# EAGLE design esp32_module (EAGLE 9.6.2)

## Sheet 1 of 2
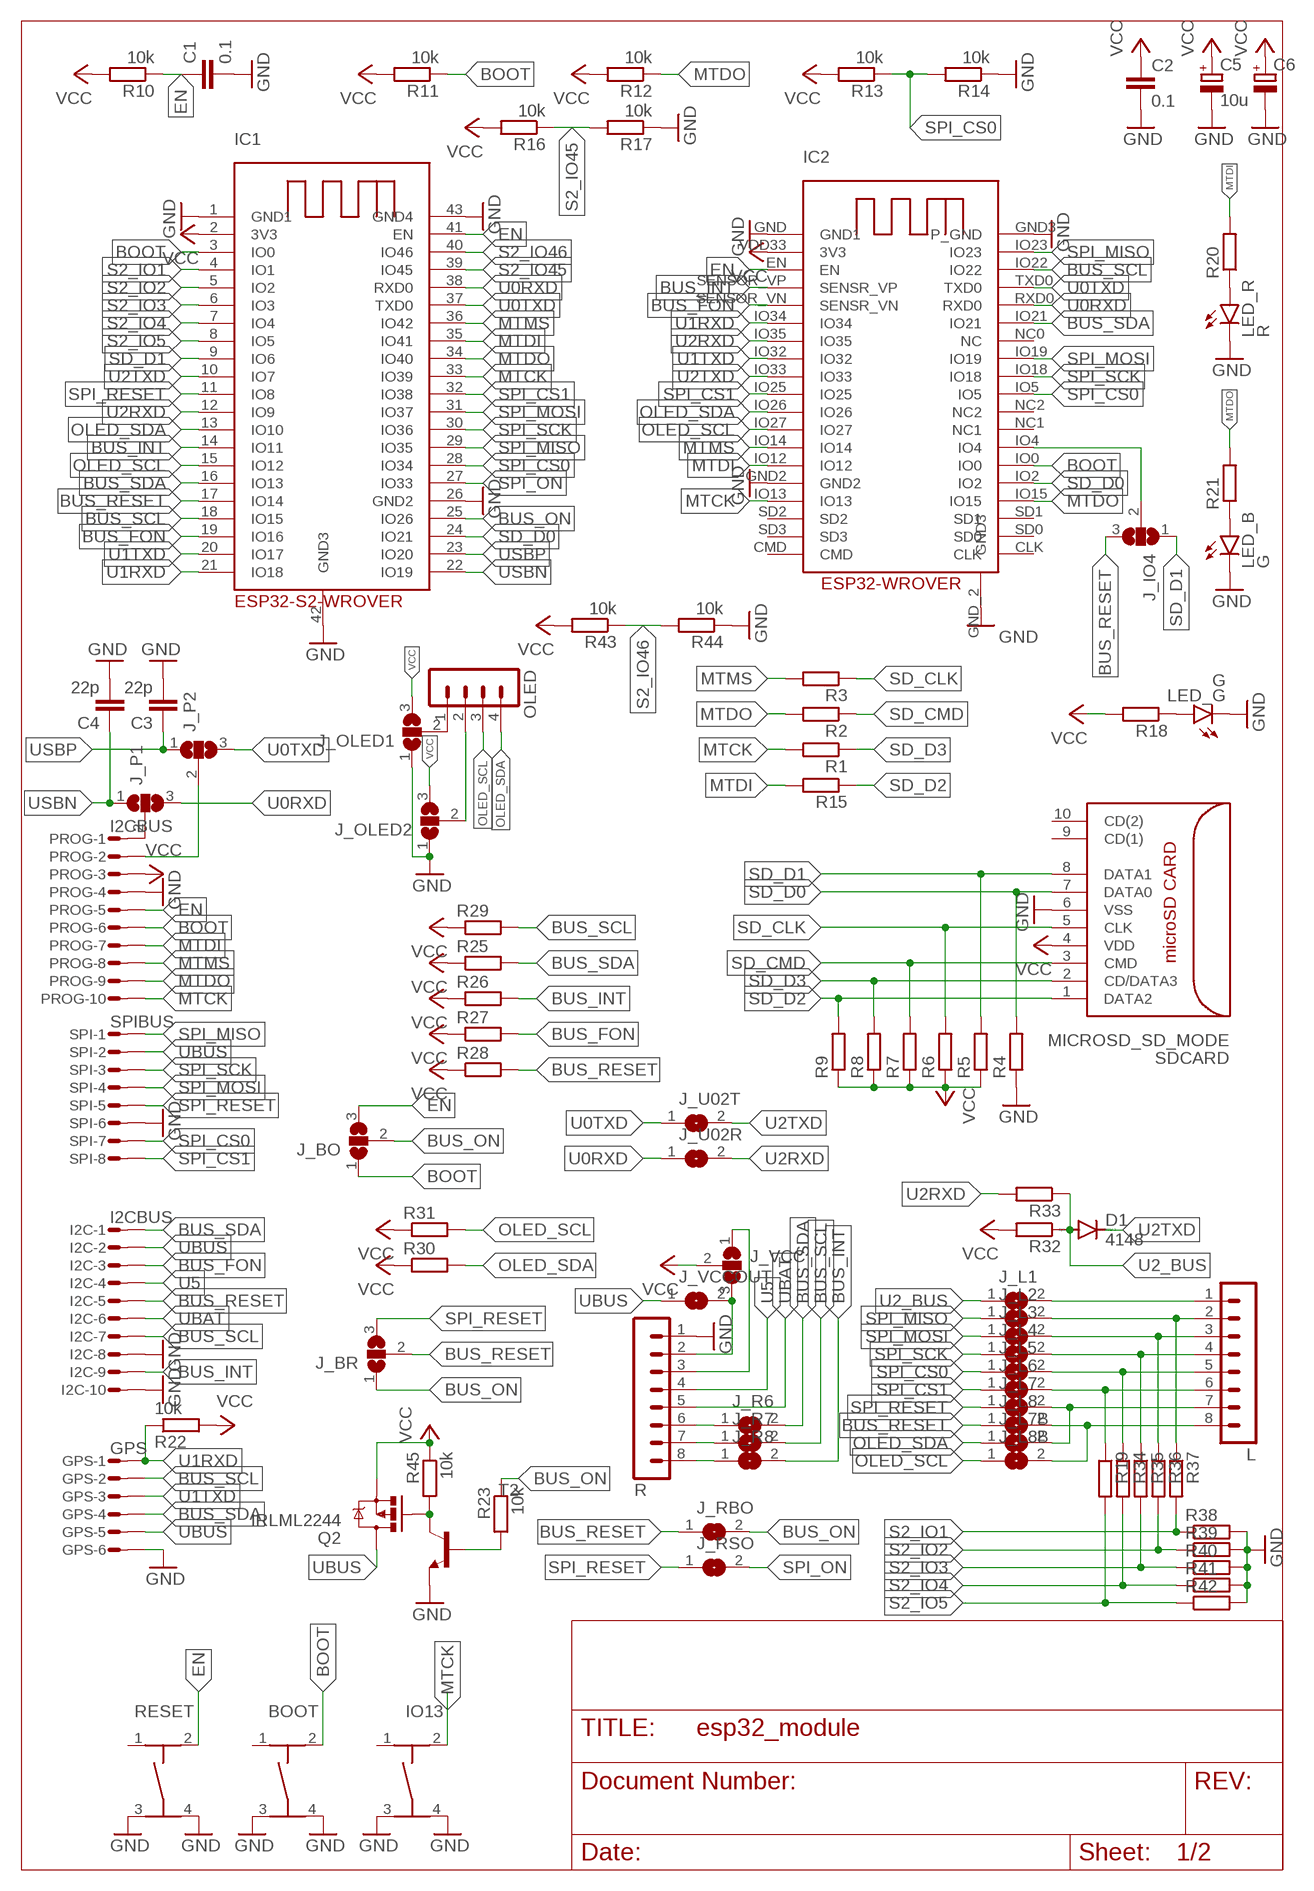
[diagram p0: schematic, sheet 1]

### Parts
BOOT  TASTER-9314_SMD  [TASTER-9314_SMD]
C1  0.1  C-EUC0805  [C0805]
C2  0.1  C-EUC0805  [C0805]
C3  22p  C-EUC0805  [C0805]
C4  22p  C-EUC0805  [C0805]
C5  10u  CPOL-EUB/3528-21W  [B/3528-21W]
C6  CPOL-EUC/6032-28R  [C/6032-28R]
D1  4148  DIODE-MINIMELF  [MINIMELF]
GPS  GPS  MICROMATCH-6SMD  [MICROMATCH-6SMD]
I2C  I2CBUS  MICROMATCH-10SMD  [MICROMATCH-10SMD]
IC1  ESP32-S2_WROVER  [ESP32-S2-WROVER]
IC2  ESP32-WROVER  [ESP32-WROVER]
IO13  TASTER-9314_SMD  [TASTER-9314_SMD]
J_BO  SJ2W  [SJ_2]
J_BR  SJ2W  [SJ_2]
J_IO4  SJ2W  [SJ_2]
J_L1  SJ  [SJ]
J_L2  SJ  [SJ]
J_L3  SJ  [SJ]
J_L4  SJ  [SJ]
J_L5  SJ  [SJ]
J_L6  SJ  [SJ]
J_L7  SJ  [SJ]
J_L7B  SJ  [SJ]
J_L8  SJ  [SJ]
J_L8B  SJ  [SJ]
J_OLED1  SJ2W  [SJ_2]
J_OLED2  SJ2W  [SJ_2]
J_P1  SJ2W  [SJ_2]
J_P2  SJ2W  [SJ_2]
J_R6  SJ  [SJ]
J_R7  SJ  [SJ]
J_R8  SJ  [SJ]
J_RBO  SJ  [SJ]
J_RSO  SJ  [SJ]
J_U02R  SJ  [SJ]
J_U02T  SJ  [SJ]
J_VCC  SJ2W  [SJ_2]
J_VCCOUT  SJ  [SJ]
L  MA08-1  [MA08-1]
LED_B  G  LEDCHIPLED_0805  [CHIPLED_0805]
LED_G  G  LEDCHIPLED_0805  [CHIPLED_0805]
LED_R  R  LEDCHIPLED_0805  [CHIPLED_0805]
OLED  MA04-1  [MA04-1]
PROG  I2CBUS  MICROMATCH-10SMD  [MICROMATCH-10SMD]
Q2  IRLML2244  MOSFET-PCHANNELIRLML2244  [SOT23-3]
R  MA08-1  [MA08-1]
R1  R-EU_R0805  [R0805]
R2  R-EU_R0805  [R0805]
R3  R-EU_R0805  [R0805]
R4  R-EU_R0805  [R0805]
R5  R-EU_R0805  [R0805]
R6  R-EU_R0805  [R0805]
R7  R-EU_R0805  [R0805]
R8  R-EU_R0805  [R0805]
R9  R-EU_R0805  [R0805]
R10  10k  R-EU_R0805  [R0805]
R11  10k  R-EU_R0805  [R0805]
R12  10k  R-EU_R0805  [R0805]
R13  10k  R-EU_R0805  [R0805]
R14  10k  R-EU_R0805  [R0805]
R15  R-EU_R0805  [R0805]
R16  10k  R-EU_R0805  [R0805]
R17  10k  R-EU_R0805  [R0805]
R18  R-EU_R0603  [R0603]
R19  R-EU_R0805  [R0805]
R20  R-EU_R0603  [R0603]
R21  R-EU_R0603  [R0603]
R22  10k  R-EU_R0805  [R0805]
R23  10k  R-EU_R0805  [R0805]
R25  R-EU_R0805  [R0805]
R26  R-EU_R0805  [R0805]
R27  R-EU_R0805  [R0805]
R28  R-EU_R0805  [R0805]
R29  R-EU_R0805  [R0805]
R30  R-EU_R0805  [R0805]
R31  R-EU_R0805  [R0805]
R32  R-EU_R0805  [R0805]
R33  R-EU_R0805  [R0805]
R34  R-EU_R0805  [R0805]
R35  R-EU_R0805  [R0805]
R36  R-EU_R0805  [R0805]
R37  R-EU_R0805  [R0805]
R38  R-EU_R0805  [R0805]
R39  R-EU_R0805  [R0805]
R40  R-EU_R0805  [R0805]
R41  R-EU_R0805  [R0805]
R42  R-EU_R0805  [R0805]
R43  10k  R-EU_R0805  [R0805]
R44  10k  R-EU_R0805  [R0805]
R45  10k  R-EU_R0805  [R0805]
RESET  TASTER-9314_SMD  [TASTER-9314_SMD]
SDCARD  MICROSD_SD_MODE  [MICRO_SD_CONNECTOR]
SPI  SPIBUS  MICROMATCH-8SMD  [MICROMATCH-8-SMD]
T2  BC817-16-NPN-SOT23-BEC  [SOT23-BEC]

### Nets
BOOT: BOOT.2 IC1.3(IO0) IC2.IO0 J_BO.1 PROG.6 R11.1
BUS_FON: I2C.3 IC1.19(IO16) IC2.SENSOR_VN(SENSR_VN) R27.2
BUS_INT: I2C.9 IC1.14(IO11) IC2.SENSOR_VP(SENSR_VP) J_R8.2 R26.2
BUS_ON: IC1.25(IO26) J_BO.2 J_BR.1 J_RBO.2 R23.1
BUS_RESET: I2C.5 IC1.17(IO14) J_BR.2 J_IO4.3 J_L8.1 J_RBO.1 R28.2
BUS_SCL: GPS.2 I2C.7 IC1.18(IO15) IC2.IO22 J_R7.2 R29.2
BUS_SDA: GPS.4 I2C.1 IC1.16(IO13) IC2.IO21 J_R6.2 R25.2
EN: C1.1 IC1.41(EN) IC2.EN J_BO.3 PROG.5 R10.1 RESET.2
GND [gnd]: BOOT.3 BOOT.4 C1.2 C2.2 C3.2 C4.2 C5.- C6.- GPS.6 I2C.8 I2C.10 IC1.1(GND1) IC1.26(GND2) IC1.42(GND3) IC1.43(GND4) IC2.GND2 IC2.GND3(P_GND) IC2.GND(GND1) IC2.GND_2(GND3) IO13.3 IO13.4 J_OLED1.1 J_OLED2.1 LED_B.C LED_G.C LED_R.C PROG.4 R4.1 R14.1 R17.1 R38.2 R39.2 R40.2 R41.2 R42.2 R44.1 R.1 RESET.3 RESET.4 SDCARD.6(VSS) SPI.6 T2.E
LCD_1 [power]: J_OLED1.2 OLED.1
LCD_2 [power]: J_OLED2.2 OLED.2
MTCK: IC1.33(IO39) IC2.IO13 IO13.2 PROG.10 R1.2
MTDI: IC1.35(IO41) IC2.IO12 PROG.7 R15.2 R20.2
MTDO: IC1.34(IO40) IC2.IO15 PROG.9 R2.2 R12.1 R21.2
MTMS: IC1.36(IO42) IC2.IO14 PROG.8 R3.2
N$1: IC2.IO4 J_IO4.2
N$2: Q2.1(G) R45.2 T2.C
N$3: J_R6.1 R.6
N$4: LED_G.A R18.1
N$5: J_R7.1 R.7
N$6: J_P1.2 PROG.1
N$12: J_R8.1 R.8
N$18: R23.2 T2.B
N$20: LED_R.A R20.1
N$21: LED_B.A R21.1
N$24: J_L7.2 J_L7B.2 L.7
N$25: J_L6.2 L.6 R19.1
N$27: J_L8.2 J_L8B.2 L.8
N$28: J_L5.2 L.5 R34.1
N$29: J_L4.2 L.4 R35.1
N$30: J_L2.2 L.2 R37.1
N$31: J_L3.2 L.3 R36.1
N$32: J_L1.2 L.1
N$34: J_P2.2 PROG.2
OLED_SCL: IC1.15(IO12) IC2.IO27 J_L8B.1 OLED.3 R31.2
OLED_SDA: IC1.13(IO10) IC2.IO26 J_L7B.1 OLED.4 R30.2
S2_IO1: IC1.4(IO1) R37.2 R38.1
S2_IO2: IC1.5(IO2) R36.2 R39.1
S2_IO3: IC1.6(IO3) R35.2 R40.1
S2_IO4: IC1.7(IO4) R34.2 R41.1
S2_IO5: IC1.8(IO5) R19.2 R42.1
S2_IO45: IC1.39(IO45) R16.1 R17.2
S2_IO46: IC1.40(IO46) R43.1 R44.2
SD_CLK: R3.1 R6.2 SDCARD.5(CLK)
SD_CMD: R2.1 R7.2 SDCARD.3(CMD)
SD_D0: IC1.24(IO21) IC2.IO2 R4.2 SDCARD.7(DATA0)
SD_D1: IC1.9(IO6) J_IO4.1 R5.2 SDCARD.8(DATA1)
SD_D2: R9.2 R15.1 SDCARD.1(DATA2)
SD_D3: R1.1 R8.2 SDCARD.2(CD/DATA3)
SPI_CS0: IC1.28(IO34) IC2.IO5 J_L5.1 R13.1 R14.2 SPI.7
SPI_CS1: IC1.32(IO38) IC2.IO25 J_L6.1 SPI.8
SPI_MISO: IC1.29(IO35) IC2.IO23 J_L2.1 SPI.1
SPI_MOSI: IC1.31(IO37) IC2.IO19 J_L3.1 SPI.4
SPI_ON: IC1.27(IO33) J_RSO.2
SPI_RESET: IC1.11(IO8) J_BR.3 J_L7.1 J_RSO.1 SPI.5
SPI_SCK: IC1.30(IO36) IC2.IO18 J_L4.1 SPI.3
U0RXD: IC1.38(RXD0) IC2.RXD0 J_P1.3 J_U02R.1
U0TXD: IC1.37(TXD0) IC2.TXD0 J_P2.3 J_U02T.1
U1RXD: GPS.1 IC1.21(IO18) IC2.IO34 R22.1
U1TXD: GPS.3 IC1.20(IO17) IC2.IO32
U2_BUS: D1.A J_L1.1 R32.1 R33.1
U2RXD: IC1.12(IO9) IC2.IO35 J_U02R.2 R33.2
U2TXD: D1.C IC1.10(IO7) IC2.IO33 J_U02T.2
U5 [power]: I2C.4 R.4
U33A [power]: J_VCC.3 J_VCCOUT.2 R.2
U33B [power]: J_VCC.1 R.3
UBAT [power]: I2C.6 R.5
UBUS [power]: GPS.5 I2C.2 J_VCCOUT.1 Q2.3(D) SPI.2
USBN: C4.1 IC1.22(IO19) J_P1.1
USBP: C3.1 IC1.23(IO20) J_P2.1
VCC [power]: C2.1 C5.+ C6.+ IC1.2(3V3) IC2.VDD33(3V3) J_OLED1.3 J_OLED2.3 J_VCC.2 PROG.3 Q2.2(S) R5.1 R6.1 R7.1 R8.1 R9.1 R10.2 R11.2 R12.2 R13.2 R16.2 R18.2 R22.2 R25.1 R26.1 R27.1 R28.1 R29.1 R30.1 R31.1 R32.2 R43.2 R45.1 SDCARD.4(VDD)
Unconnected: BOOT.1 IC2.CLK IC2.CMD IC2.NC0(NC) IC2.NC1 IC2.NC2 IC2.SD0 IC2.SD1 IC2.SD2 IC2.SD3 IO13.1 RESET.1 SDCARD.9(CD(1)) SDCARD.10(CD(2))

## Sheet 2 of 2

## Library data of the parts
BOOT IO13 RESET = Ergaenzung:TASTER-9314_SMD
C1-C4 = rcl:C-EU: CAPACITOR, European symbol; SPICEPREFIX: C
C5 C6 = rcl:CPOL-EU: POLARIZED CAPACITOR, European symbol; SPICEPREFIX: C
D1 = diode:DIODE-: DIODE
GPS = con-amp-micromatch:MICROMATCH-6: MicroMaTch 6 7-215464-6 / 0-215464-6 Drawing Number C-215464 DDEController.pdf
I2C PROG = con-amp-micromatch:MICROMATCH-10: MicroMaTch 10 8-215464-0 / 1-215464-0 Drawing Number C-215464 DDEController.pdf
IC1 = ESP32-Wrover:ESP32-S2_WROVER
IC2 = ESP32-Wrover:ESP32-WROVER
J_BO J_BR J_IO4 J_OLED1 J_OLED2 J_P1 J_P2 J_VCC = jumper:SJ2W: SMD solder JUMPER
J_L1-J_L7 J_L7B J_L8 J_L8B J_R6-J_R8 J_RBO J_RSO J_U02R J_U02T J_VCCOUT = jumper:SJ: SMD solder JUMPER
L R = con-lstb:MA08-1: PIN HEADER; OC_FARNELL: unknown; OC_NEWARK: unknown
LED_B LED_G LED_R = led:LED: LED OSRAM: - CHIPLED LG R971, LG N971, LY N971, LG Q971, LY Q971, LO R971, LY R971 LH N974, LH R974 LS Q976, LO Q976, LY Q976 LO Q996 - Hyper CHIPLED LW Q18S LB Q993, LB Q99A, LB R99A - SideLED LS A670, LO A670, LY A670, LG A670, LP A670 LB A673, LV A673, LT A673, LW A673 LH A674 LY A675 LS A676, LA A676, LO A676, LY A676, LW A676 LS A679, LY A679, LG A679 - Hyper Micro SIDELED® LS Y876, LA Y876, LO Y876, LY Y876 LT Y87S - SmartLED LW L88C, LW L88S LB L89C, LB L89S, LG L890 LS L89K, LO L89K, LY L89K LS L896, LA L896, LO L896, LY L896 - TOPLED LS T670, LO T670, LY T670, LG T670, LP T670 LSG T670, LSP T670, LSY T670, LOP T670, LYG T670 LG T671, LOG T671, LSG T671 LB T673, LV T673, LT T673, LW T673 LH T674 LS T676, LA T676, LO T676, LY T676, LB T676, LH T676, LSB T676, LW T676 LB T67C, LV T67C, LT T67C, LS T67K, LO T67K, LY T67K, LW E67C LS E67B, LA E67B, LO E67B, LY E67B, LB E67C, LV E67C, LT E67C LW T67C LS T679, LY T679, LG T679 LS T770, LO T770, LY T770, LG T770, LP T770 LB T773, LV T773, LT T773, LW T773 LH T774 LS E675, LA E675, LY E675, LS T675 LS T776, LA T776, LO T776, LY T776, LB T776 LHGB T686 LT T68C, LB T68C - Hyper Mini TOPLED® LB M676 - Mini TOPLED Santana® LG M470 LS M47K, LO M47K, LY M47K Source: http://www.osram.convergy.de LUXEON: - LUMILED® LXK2-PW12-R00, LXK2-PW12-S00, LXK2-PW14-U00, LXK2-PW14-V00 LXK2-PM12-R00, LXK2-PM12-S00, LXK2-PM14-U00 LXK2-PE12-Q00, LXK2-PE12-R00, LXK2-PE12-S00, LXK2-PE14-T00, LXK2-PE14-U00 LXK2-PB12-K00, LXK2-PB12-L00, LXK2-PB12-M00, LXK2-PB14-N00, LXK2-PB14-P00, LXK2-PB14-Q00 LXK2-PR12-L00, LXK2-PR12-M00, LXK2-PR14-Q00, LXK2-PR14-R00 LXK2-PD12-Q00, LXK2-PD12-R00, LXK2-PD12-S00 LXK2-PH12-R00, LXK2-PH12-S00 LXK2-PL12-P00, LXK2-PL12-Q00, LXK2-PL12-R00 Source: www.luxeon.com KINGBRIGHT: KA-3528ASYC Source: www.kingbright.com
OLED = con-lstb:MA04-1: PIN HEADER; OC_FARNELL: unknown; OC_NEWARK: unknown
Q2 = User-Submitted:MOSFET-PCHANNEL: Generic PMOSFET IRLML2244 - TRANS-11153 (SOT-23 -20V -4.3A) (1.Gate 2.Source 3.Drain) FQP27P06 - COM-10349 <http://www.sparkfun.com/products/10349> (TO-220 -60V -27A) (1.Gate 2.Source 3.Drain); PROD_ID: TRANS-11153
R1-R23 R25-R45 = rcl:R-EU_: RESISTOR, European symbol; SPICEPREFIX: R
SDCARD = con-molex-microsd:MICROSD_SD_MODE: MOLEX - 49225-0821 - CONNECTEUR MICRO SD PUSH/PUSH REV Fabricant: MOLEX Code commande Farnell: 1366700 <http://fr.farnell.com/molex/49225-0821/connecteur-micro-sd-push-push-rev/dp/1366700?Ntt=1366700> Référence fabricant: 49225-0821
SPI = con-amp-micromatch:MICROMATCH-8: MicroMaTch 8 7-215464-8 / 0-215464-8 Drawing Number C-215464 DDEController.pdf
T2 = transistor:*-NPN-: NPN Transistror BF959 corrected 2008.03.06

## Net classes
1 gnd: width 0.508 mm, drill 0.254 mm
2 power: width 0.508 mm, drill 0.254 mm

## Board
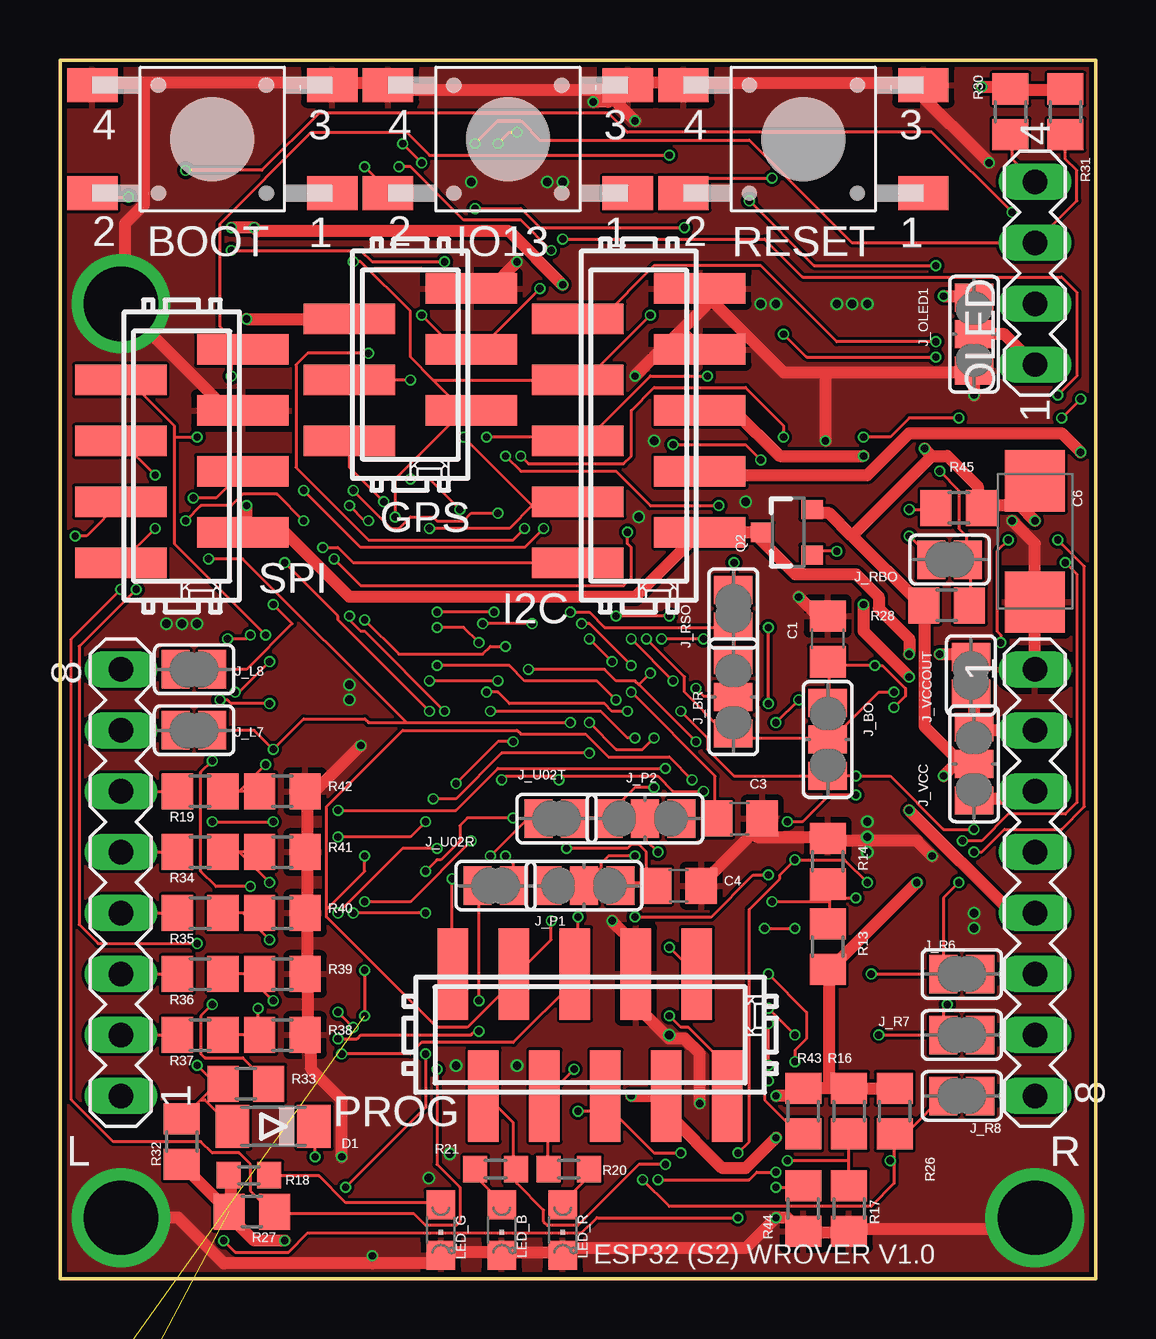
[diagram p1: board, top side]
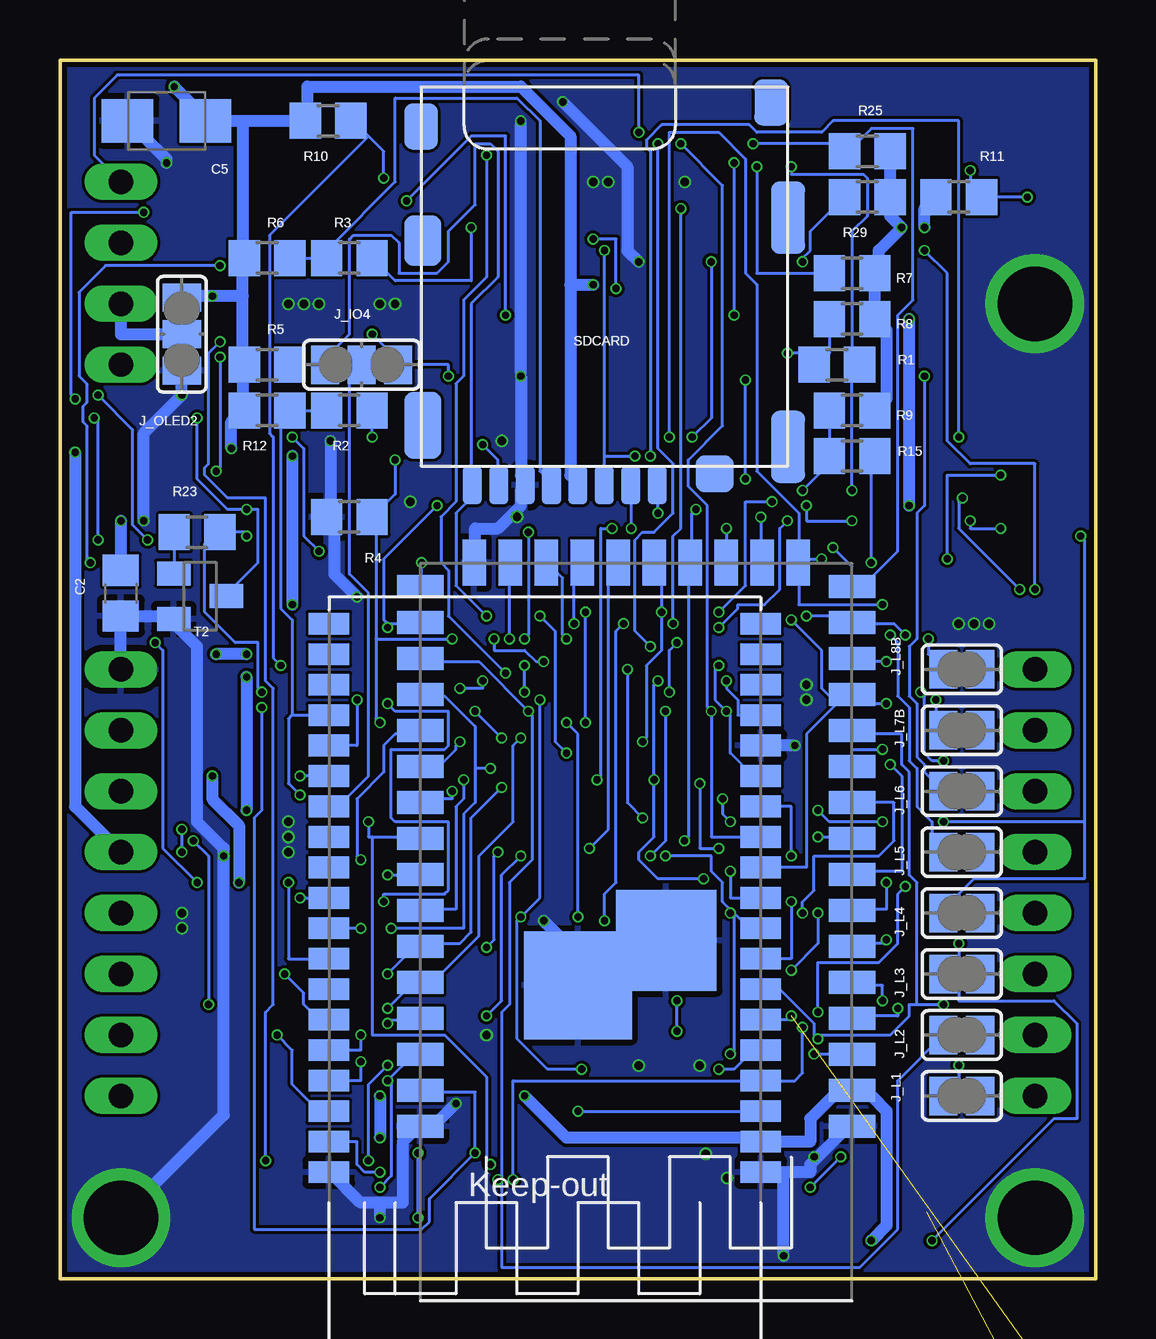
[diagram p2: board, bottom side, seen from below]

Size 43.18 x 50.8 mm. Coordinates in mm from the lower left corner, seen from the top.
Outline: 0,0 43.18,0 43.18,50.8 0,50.8 0,0
Copper layers (1*16): Top 0.035559375mm / dielectric 1.6mm / Bottom 0.035559375mm
Design rules "jlcpcb2layer": minimum track width 5mil, minimum drill 12mil, track to track 5mil, track to pad 5mil, pad to pad 5mil, via to via 5mil, smd to smd 5mil, copper to edge 8mil, drill to drill 6mil, minimum pad ring 5mil, minimum via ring 3mil, stop-mask expansion 2.5mil, vias tented up to drill 0mil, thermal gap 10mil

### Footprints (pad centres in the part's own frame; a part is rotated, then mirrored left to right if it is on the bottom)
TASTER-9314_SMD = smd 2.1 x 1.4: 1 -5,2.25; 2 5,2.25; 3 -5,-2.25; 4 5,-2.25
C0805 = smd 1.3 x 1.5: 1 -0.95,0; 2 0.95,0
B/3528-21W = smd 2.15 x 1.8: + 1.625,0; - -1.625,0
C/6032-28R = smd 2.55 x 2.5: + 2.525,0; - -2.525,0
MINIMELF = smd 1.4 x 1.8: A 1.7,0; C -1.7,0
MICROMATCH-6SMD = smd 1.27 x 3.81: 1 3.175,-2.54; 2 1.905,2.54; 3 0.635,-2.54; 4 -0.635,2.54; 5 -1.905,-2.54; 6 -3.175,2.54
MICROMATCH-10SMD = smd 1.27 x 3.81: 1 5.715,-2.54; 2 4.445,2.54; 3 3.175,-2.54; 4 1.905,2.54; 5 0.635,-2.54; 6 -0.635,2.54; 7 -1.905,-2.54; 8 -3.175,2.54; 9 -4.445,-2.54; 10 -5.715,2.54
ESP32-S2-WROVER = smd 1.93 x 0.965: 1 0,0; 2 0,-1.5; 3 0,-3; 4 0,-4.5; 5 0,-6; 6 0,-7.5; 7 0,-9; 8 0,-10.5; 9 0,-12; 10 0,-13.5; 11 0,-15; 12 0,-16.5; 13 0,-18; 14 0,-19.5; 15 0,-21; 16 0,-22.5; 27 18,-22.5; 28 18,-21; 29 18,-19.5; 30 18,-18; 31 18,-16.5; 32 18,-15; 33 18,-13.5; 34 18,-12; 35 18,-10.5; 36 18,-9; 37 18,-7.5; 38 18,-6; 39 18,-4.5; 40 18,-3; 41 18,-1.5; 42 18,0 | smd 0.965 x 1.93: 17 2.25,-23.5; 18 3.75,-23.5; 19 5.25,-23.5; 20 6.75,-23.5; 21 8.25,-23.5; 22 9.75,-23.5; 23 11.25,-23.5; 24 12.75,-23.5; 25 14.25,-23.5; 26 15.75,-23.5 | smd 4.2 x 4.2: 43 7.75,-7.75
ESP32-WROVER = smd 1.7 x 0.9: CLK 18,1.27; CMD 0,1.27; EN 0,21.59; GND 0,24.13; GND3 18,24.13; GND_2 0,6.35; IO0 18,7.62; IO2 18,6.35; IO4 18,8.89; IO5 18,12.7; IO12 0,7.62; IO13 0,5.08; IO14 0,8.89; IO15 18,5.08; IO18 18,13.97; IO19 18,15.24; IO21 18,17.78; IO22 18,21.59; IO23 18,22.86; IO25 0,12.7; IO26 0,11.43; IO27 0,10.16; IO32 0,15.24; IO33 0,13.97; IO34 0,17.78; IO35 0,16.51; NC0 18,16.51; NC1 18,10.16; NC2 18,11.43; RXD0 18,19.05; SD0 18,2.54; SD1 18,3.81; SD2 0,3.81; SD3 0,2.54; SENSOR_VN 0,19.05; SENSOR_VP 0,20.32; TXD0 18,20.32; VDD33 0,22.86 | smd 4.5 x 4.5: GND2 7.62,16.34
SJ_2 = smd 1.168 x 1.6: 1 -1.524,0; 2 0,0; 3 1.524,0
SJ = smd 1.168 x 1.6: 1 -0.762,0; 2 0.762,0
MA08-1 = drill 1.016 long: 1 -8.89,0; 2 -6.35,0; 3 -3.81,0; 4 -1.27,0; 5 1.27,0; 6 3.81,0; 7 6.35,0; 8 8.89,0
CHIPLED_0805 = smd 1.2 x 1.2: A 0,-1.05; C 0,1.05
MA04-1 = drill 1.016 long: 1 -3.81,0; 2 -1.27,0; 3 1.27,0; 4 3.81,0
SOT23-3 = smd 0.8 x 0.9: 1 -0.95,-1; 2 0.95,-1; 3 0,1.1
R0805 = smd 1.3 x 1.5: 1 -0.95,0; 2 0.95,0
R0603 = smd 1 x 1.1: 1 -0.85,0; 2 0.85,0
MICRO_SD_CONNECTOR = smd 0.8 x 1.6: 1 -2.03,8.2; 2 -0.93,8.2; 3 0.17,8.2; 4 1.27,8.2; 5 2.37,8.2; 6 3.47,8.2; 7 4.57,8.2; 8 5.67,8.2 | smd 1.55 x 2.8: 9 7.735,5.7 | smd 1.55 x 2.1: 10 7.735,-2 | smd 1.4 x 1.9: 11 7.81,-6.75; 12 -6.79,-7.75 | smd 1.4 x 3: 13 -7.49,-2.95; 14 -7.49,6.6 | smd 1.6 x 1.55: 15 -4.43,7.725
MICROMATCH-8-SMD = smd 1.27 x 3.81: 1 4.445,-2.54; 2 3.175,2.54; 3 1.905,-2.54; 4 0.635,2.54; 5 -0.635,-2.54; 6 -1.905,2.54; 7 -3.175,-2.54; 8 -4.445,2.54
SOT23-BEC = smd 1 x 1.4: B -0.95,-1.1; C 0,1.1; E 0.95,-1.1

### Placement (x,y rotation side)
BOOT  6.35,47.5 180 top
C1  32,26.67 90 top
C2  40.64,28.57 270 bottom
C3  28.32,19.18 0 top
C4  25.78,16.38 0 top
C5  38.73,48.26 0 bottom
C6  40.64,30.73 90 top
D1  8.89,6.35 180 top
GPS  14.61,38.1 270 top
I2C  24.13,35.56 270 top
IC1  10.16,6.35 180 bottom
IC2  13.97,28.57 180 bottom
IO13  18.67,47.5 180 top
J_BO  32,22.48 90 top
J_BR  28.07,24.26 90 top
J_IO4  30.61,38.1 0 bottom
J_L1  5.59,7.62 0 bottom
J_L2  5.59,10.16 0 bottom
J_L3  5.59,12.7 0 bottom
J_L4  5.59,15.24 0 bottom
J_L5  5.59,17.78 0 bottom
J_L6  5.59,20.32 0 bottom
J_L7  5.59,22.86 180 top
J_L7B  5.59,22.86 0 bottom
J_L8  5.59,25.4 180 top
J_L8B  5.59,25.4 0 bottom
J_OLED1  38.1,39.37 90 top
J_OLED2  38.1,39.37 90 bottom
J_P1  21.84,16.38 180 top
J_P2  24.38,19.18 180 top
J_R6  37.59,12.7 180 top
J_R7  37.59,10.16 180 top
J_R8  37.59,7.62 180 top
J_RBO  37.08,29.97 180 top
J_RSO  28.07,27.94 90 top
J_U02R  18.16,16.38 180 top
J_U02T  20.7,19.18 180 top
J_VCC  38.1,21.46 90 top
J_VCCOUT  37.97,25.15 270 top
L  2.54,16.51 90 top
LED_B  18.41,2.03 180 top
LED_G  15.88,2.03 180 top
LED_R  20.95,2.03 180 top
OLED  40.64,41.91 90 top
PROG  22.1,10.16 0 top
Q2  30.35,31.11 90 top
R  40.64,16.51 270 top
R1  10.79,38.1 0 bottom
R2  31.11,36.2 180 bottom
R3  31.11,42.55 0 bottom
R4  31.11,31.75 0 bottom
R5  34.54,38.1 0 bottom
R6  34.54,42.55 0 bottom
R7  10.16,41.91 180 bottom
R8  10.16,40.01 180 bottom
R9  10.16,36.2 180 bottom
R10  32,48.26 180 bottom
R11  5.71,45.09 180 bottom
R12  34.54,36.2 180 bottom
R13  32,13.84 270 top
R14  32,17.4 270 top
R15  10.16,34.29 0 bottom
R16  32.89,6.99 90 top
R17  32.89,2.92 90 top
R18  7.87,4.32 180 top
R19  5.84,20.32 0 top
R20  21.21,4.57 180 top
R21  18.16,4.57 0 top
R22  1.27,-6.35 0 top  (outside the outline)
R23  37.47,31.11 180 bottom
R25  9.53,46.99 180 bottom
R26  34.8,6.99 270 top
R27  8,2.79 0 top
R28  36.96,28.07 0 top
R29  9.53,45.09 180 bottom
R30  39.62,48.64 270 top
R31  41.91,48.64 270 top
R32  5.08,5.71 270 top
R33  7.75,8.13 0 top
R34  5.84,17.78 0 top
R35  5.84,15.24 0 top
R36  5.84,12.7 0 top
R37  5.84,10.16 0 top
R38  9.27,10.16 0 top
R39  9.27,12.7 0 top
R40  9.27,15.24 0 top
R41  9.27,17.78 0 top
R42  9.27,20.32 0 top
R43  30.99,6.99 90 top
R44  30.99,2.92 90 top
R45  37.47,32.13 180 top
RESET  30.99,47.5 180 top
SDCARD  20.32,41.27 180 bottom
SPI  5.08,34.29 270 top
T2  37.34,28.45 270 bottom

### Tracks (layer width: path | path; a pad name or v marks a point on that pad's centre or on a via)
BOOT  (via drill 0.3)
  Top 0.127: v2.86,45.09 1.59,45.09 1.43,45.24 BOOT.2 | v25.88,23.65 26.99,22.54 26.99,22.07 28.1,20.95 J_BO.1 v33.18,20.95 34.61,20.95 36.83,18.73 v38.1,18.73 | v24.77,22.54 24.29,22.07 23.18,22.07 v22.07,23.18 | v21.59,15.08 21.59,12.7 PROG.6 21.43,12.7 21.43,12.38 18.89,9.84 15.08,9.84 14.61,9.37 v11.75,9.37 | v5.24,46.2 8.41,46.2 10.79,48.58 22.86,48.58 23.65,47.78 36.35,47.78 v39.69,44.45 | v41.75,35.88 v42.55,36.67 | v41.59,30.8 42.7,29.69 42.7,19.68 41.75,18.73 39.37,18.73 38.42,17.78 v38.1,17.78
  Bottom 0.127: v2.86,45.09 R11.1 4.92,45.09 5.24,45.4 v5.24,46.2 | IC2.IO0 v33.18,20.95 | v24.77,22.54 v25.88,23.65 | v22.07,23.18 21.59,22.7 v21.59,15.08 | v11.75,9.37 10.16,9.37 IC1.3 | v39.69,44.45 42.7,44.45 42.7,36.83 v42.55,36.67 | v41.75,35.88 41.59,35.72 v41.59,30.8 | v38.1,18.73 v38.1,17.78
BUS_FON  (via drill 0.3)
  Top 0.127: v15.4,31.27 18.73,31.27 19.68,32.23 | 19.68,32.23 19.84,32.38 I2C.3 | v15.72,8.73 15.72,4.76 16.67,3.81 16.67,2.38 16.51,2.22 15.24,2.22 14.76,2.7 9.05,2.7 R27.2 8.89,2.7 7.94,3.65 7.94,4.76 7.46,5.24 6.35,5.24 5.87,5.71 2.22,5.71 0.48,7.46 0.48,26.67 v2.54,28.73 | v16.83,35.08 19.68,32.23 | v16.03,42.39 13.02,42.39 12.54,42.86 v7.14,42.86
  Bottom 0.127: v15.4,31.27 15.4,30 IC1.19 | v15.72,8.73 15.08,8.73 14.29,9.53 IC2.SENSOR_VN | v16.83,35.08 16.03,35.88 v16.03,42.39 | v7.14,42.86 6.19,41.91 6.19,34.92 5.24,33.97 2.54,33.97 v2.54,28.73
BUS_INT  (via drill 0.3)
  Top 0.127: J_R8.2 35.4,6.19 34.92,6.19 R26.2 34.77,6.03 34.77,4.92 | v24.29,4.13 25.4,3.02 33.81,3.02 34.77,3.97 34.77,4.92 | v8.73,25.72 7.46,24.45 v7.3,24.45 | v6.35,21.59 5.87,21.11 5.87,16.99 6.51,16.35 v7.94,16.35 | v12.22,10.48 v11.59,11.11 | I2C.9 22.54,40.01 24.77,42.23 29.21,42.23 32.38,39.05 v36.51,39.05 | 34.77,4.92 v34.61,4.92
  Bottom 0.127: v24.29,4.13 24.29,8.26 IC2.SENSOR_VP 12.54,8.26 12.22,8.57 v12.22,10.48 | v8.73,25.72 10.16,25.72 IC1.14 | v7.3,24.45 7.14,24.29 7.14,21.91 6.83,21.59 v6.35,21.59 | v7.94,16.35 8.26,16.03 8.26,13.97 9.05,13.18 11.59,13.18 v11.59,11.11 | v36.51,39.05 36.99,38.58 36.99,33.97 37.15,33.81 37.15,33.5 36.2,32.54 34.61,32.54 34.61,24.92 34.29,24.61 34.29,11.43 34.61,11.11 v34.61,4.92
BUS_ON  (via drill 0.3)
  Top 0.127: v35.4,30.96 36.35,30 J_RBO.2 | v24.45,26.67 26.04,25.08 26.04,24.45 27.62,22.86 27.94,22.86 J_BR.1 28.26,22.54 31.91,22.54 J_BO.2 32.07,22.38 34.13,24.45 v34.77,24.45
  Bottom 0.127: v35.4,30.96 35.4,31.11 R23.1 36.67,31.11 37.15,30.64 37.15,27.78 35.88,26.51 34.92,26.51 34.92,24.61 v34.77,24.45 | v24.45,26.67 24.45,29.84 IC1.25
BUS_RESET  (via drill 0.3)
  Top 0.127: J_L8.1 7.78,25.4 9.68,27.3 v8.89,28.1 | v26.51,24.61 26.83,24.29 27.94,24.29 J_BR.2 | v23.81,26.67 v25.56,24.92 | v23.65,31.11 23.65,30.64 23.81,30.48 23.81,29.21 23.5,28.89 12.54,28.89 v11.43,30 | R28.2 37.94,28.1 37.94,29.84 J_RBO.1 37.78,30 37.78,30.96 37.47,31.27 37.47,32.86 v36.67,33.66 | v26.99,37.62 24.61,37.62 22.07,35.08 | 22.07,35.08 21.91,34.92 I2C.5 22.07,35.08 | v36.51,38.42 31.11,38.42 v30.16,39.37 | 22.07,35.08 v17.78,35.08
  Bottom 0.127: v8.89,28.1 12.38,28.1 12.38,29.84 IC1.17 12.38,30 | v26.51,24.61 25.56,24.61 v25.56,24.92 | v23.81,26.67 23.65,26.83 v23.65,31.11 | 12.38,30 v11.43,30 | v26.99,37.62 26.99,38.1 J_IO4.3 29.21,38.1 29.21,38.42 v30.16,39.37 | v36.67,33.66 36.51,33.81 v36.51,38.42 | 12.38,30 12.38,31.91 14.13,33.66 14.13,41.43 14.61,41.91 14.61,46.67 15.72,47.78 17.78,47.78 v17.78,35.08
BUS_SCL  (via drill 0.3)
  Top 0.127: v34.13,10.16 J_R7.2 36.83,11.27 v36.99,11.43 | v12.22,42.39 12.54,42.39 14.61,40.32 14.61,38.42 15.56,37.47 | 16.83,36.2 15.56,37.47 | v13.97,31.75 13.97,33.34 16.83,36.2 | 16.83,36.2 GPS.2 | 15.56,37.47 I2C.7 21.91,37.47 v24.61,40.16 | v37.62,18.26 38.42,18.26 39.53,19.37 41.91,19.37 42.39,19.84 42.39,29.37 v41.91,29.84 | v36.51,42.23 31.43,42.23 v28.73,44.93
  Bottom 0.127: v34.13,10.16 33.5,9.53 33.5,8.1 32.38,6.99 IC2.IO22 | v12.22,42.39 12.22,42.55 11.91,42.86 11.91,43.66 R29.2 | v13.97,31.75 13.97,30 IC1.18 | v36.99,11.43 36.99,17.62 v37.62,18.26 | v41.91,29.84 42.07,30 42.07,35.56 42.23,35.72 42.23,36.35 42.07,36.51 42.07,37.31 42.39,37.62 42.39,41.12 41.27,42.23 v36.51,42.23 | v28.73,44.93 26.04,47.62 24.61,47.62 v24.61,40.16
BUS_SDA  (via drill 0.3)
  Top 0.127: v33.81,12.7 J_R6.2 36.83,15.88 v37.47,16.51 | I2C.1 12.22,29.84 11.59,30.48 v10.95,30.48 | v15.08,40.16 16.51,38.73 GPS.4 17.46,38.73 v20,41.27 | v14.29,47.31 v15.08,46.51 | v39.21,26.51 39.21,26.83 39.05,26.99 39.05,30.32 v39.53,30.8 | v41.59,36.83 42.39,37.62 42.39,41.12 41.75,41.75 30.96,41.75 29.37,43.34 v20.95,43.34
  Bottom 0.127: v33.81,12.7 33.02,11.91 33.02,11.43 32.38,10.79 IC2.IO21 | 10.16,28.89 9.68,28.89 8.26,30.32 8.26,40.16 7.62,40.8 7.62,47.94 9.37,47.94 10.32,46.99 R25.2 10.48,47.31 v14.29,47.31 | v10.95,30.48 10.16,29.69 10.16,28.89 | 10.16,28.89 IC1.16 | v15.08,46.51 v15.08,40.16 | v37.47,16.51 38.89,17.94 38.89,26.19 v39.21,26.51 | v39.53,30.8 40.16,31.43 40.16,35.4 v41.59,36.83 | v20.95,43.34 20,43.34 v20,41.27
EN  (via drill 0.3)
  Top 0.127: v21.59,6.99 22.07,6.99 22.54,7.46 | 22.54,7.46 22.7,7.62 PROG.5 22.54,7.46 | v25.88,5.24 24.77,5.24 22.54,7.46 | 32.07,25.56 32.07,24.13 J_BO.3 | 32.07,25.56 32.07,25.72 C1.1 32.07,25.56 | v29.69,45.88 26.51,45.88 26.04,45.4 RESET.2 | 32.07,25.56 v33.97,25.56 34.29,25.56 35.24,24.61 35.24,24.29 v34.77,23.81
  Bottom 0.127: v21.59,6.99 IC2.EN | IC1.41 28.1,7.78 25.88,7.78 v25.88,5.24 27.78,3.33 27.78,2.38 28.1,2.06 35.08,2.06 35.08,19.21 34.77,19.53 v34.77,23.81 | 30.32,47.62 29.69,46.99 v29.69,45.88 | 30.32,47.62 30.96,48.26 R10.1 | v33.97,25.56 34.29,25.88 34.29,35.08 34.45,35.24 34.45,43.5 30.32,47.62
GND  (via drill 0.3, 0.35, 3.1)
  Top 0.508: SPI.6 6.99,36.2 v2.54,40.64 2.7,40.8 2.7,43.97 3.49,44.77 3.49,49.85 | 3.49,49.85 11.27,49.85 BOOT.3 11.59,49.85 13.65,49.85 IO13.4 13.81,49.53 23.02,49.53 IO13.3 | 3.49,49.85 1.43,49.85 BOOT.4 | IO13.3 23.81,49.85 25.88,49.85 RESET.4 26.19,49.85 35.88,49.85 RESET.3 35.56,49.69 v38.73,46.51 | GPS.6 17.94,41.27 v19.05,42.39 | v22.23,49.05 22.86,49.05 23.5,49.69 IO13.3 | v12.54,22.23 10.48,20.16 R42.2 10.32,20.32 10.32,17.94 R41.2 10.32,17.78 10.32,15.4 R40.2 10.32,15.24 10.32,12.86 R39.2 10.32,12.7 10.32,10.16 R38.2 10.48,10 10.48,8.73 11.75,7.46 v11.75,5.08 | v2.54,2.54 4.92,2.54 6.83,0.64 13.02,0.64 | 13.02,0.64 15.56,0.64 15.72,0.79 LED_G.C 15.88,1.11 18.41,1.11 LED_B.C 18.57,1.11 20.95,1.11 LED_R.C 21.11,1.27 28.57,1.27 v29.84,2.54 30.32,2.54 30.8,2.06 R44.1 31.11,1.91 32.86,1.91 R17.1 33.02,2.06 40.16,2.06 v40.64,2.54 | v13.02,0.95 13.02,0.64 | v30.8,28.42 31.59,27.62 31.91,27.62 C1.2 | v38.1,36.83 J_OLED1.1 37.94,37.78 31.91,37.78 | 31.91,37.78 30.16,37.78 27.15,40.8 | I2C.10 27.15,40.8 | 31.91,37.78 v31.91,34.92 | 27.15,40.8 25.88,39.53 | 25.88,39.53 v23.97,37.62 | 25.88,39.53 I2C.8 | v23.02,14.92 23.97,13.97 23.97,12.7 PROG.4 24.13,12.54 24.13,11.27 25.4,10 26.04,10 26.67,9.37 v26.67,7.3 | 28.89,18.57 29.37,19.05 C3.2 | 28.89,18.57 26.83,16.51 C4.2 | 28.89,18.57 29.05,18.41 31.91,18.41 R14.1 32.23,18.26 35.72,18.26 v36.35,17.62 | R.1 C6.- 40.64,30.64 v39.69,31.59 | v23.97,48.26 23.18,49.05 IO13.3
  Bottom 0.508: v38.73,46.51 38.73,46.67 40.32,48.26 C5.- | v19.05,42.39 19.53,42.86 19.53,46.35 v22.23,49.05 | v12.54,22.23 IC2.GND_2 | 13.02,4.45 11.91,4.45 11.91,4.76 11.67,5 | 13.02,4.45 IC2.GND | 11.67,5 10.32,6.35 IC1.1 | v13.02,0.95 13.02,4.45 | v11.75,5.08 11.67,5 | IC1.26 25.88,30 25.88,31.27 24.92,31.27 23.97,32.23 23.97,32.86 23.81,33.02 SDCARD.6 23.81,33.34 23.97,33.5 v23.97,37.62 v23.97,48.26 | v30.8,28.42 31.75,29.37 31.75,31.59 31.91,31.75 R4.1 31.91,31.91 v31.91,34.92 | J_OLED1.1 v38.1,36.83 39.69,35.24 v39.69,31.59 | v23.02,14.92 21.59,13.49 IC2.GND2 21.75,13.97 17.94,13.97 IC1.43 | R.1 C2.2 38.58,27.62 T2.E 38.42,27.3 37.47,26.35 37.47,19.05 36.35,17.94 v36.35,17.62 36.35,6.83 v40.64,2.54 | 29.84,3.17 28.89,3.17 28.89,5.71 28.26,6.35 IC1.42 27.62,6.35 v26.67,7.3 | 29.84,3.17 30.64,3.17 31.91,4.45 IC2.GND3 | v29.84,2.54 29.84,3.17
  other vias: 4.45,27.3 5.08,27.3 5.71,27.3 12.06,24.13 12.06,24.77 38.1,15.24 38.1,14.61 33.66,19.05 33.66,18.41 33.66,17.78 24.77,34.92 24.13,31.75 28.57,32.38 33.66,40.64 33.02,40.64 32.38,40.64 29.84,40.64 29.21,40.64 20.32,45.72 20.95,45.72 17.14,45.72 25.4,10.16 19.05,8.89 16.51,8.89 16.26,5.21 15.37,4.19
  pour Top: 0,0 43.18,0 43.18,50.8 0,50.8
  pour Bottom: 0,0 43.18,0 43.18,50.8 0,50.8
LCD_1
  Top 0.508: J_OLED1.2 39.37,39.37 OLED.1
LCD_2
  Bottom 0.508: J_OLED2.2 40.64,39.37 OLED.2
MTCK  (via drill 0.3)
  Top 0.127: v12.7,46.35 13.65,45.4 IO13.2 | v18.26,24.92 v15.4,24.92 | v16.35,16.67 16.35,12.7 PROG.10 | v26.83,20.32 25.56,20.32 24.92,20.95 20.8,20.95 | 20.8,20.95 18.57,20.95 v18.41,20.8 | v10.16,32.86 12.54,30.48 19.37,30.48 v20.16,31.27 | 20.8,20.95 v20.8,20.8
  Bottom 0.127: 10,38.1 10.16,38.26 10.16,43.66 9.53,44.29 9.53,45.88 9.68,46.04 12.7,46.04 v12.7,46.35 | IC2.IO13 14.92,23.5 14.92,24.13 15.4,24.61 v15.4,24.92 | v18.26,24.92 18.41,24.77 v18.41,20.8 18.41,18.41 19.05,17.78 19.05,17.46 18.26,16.67 v16.35,16.67 | v26.83,20.32 26.83,20 28.1,20 IC1.33 | 10,38.1 10.16,37.94 v10.16,32.86 | v20.16,31.27 20.64,31.27 20.64,20.95 v20.8,20.8 | 10,38.1 R1.2
MTDI  (via drill 0.3)
  Top 0.127: v9.37,29.84 11.59,27.62 11.59,27.46 v15.4,23.65 | 20.32,7.62 20.32,4.6 R20.2 | v29.53,16.83 28.89,16.83 27.15,15.08 v23.97,15.08 | 20.32,7.62 v21.43,8.73 | 20.32,7.62 PROG.7 | v15.72,25.56 18.73,25.56 19.37,24.92 22.38,24.92 v23.18,24.13
  Bottom 0.127: v9.37,29.84 9.37,34.29 R15.2 | IC2.IO12 14.29,20.95 15.24,21.91 15.24,23.5 v15.4,23.65 15.88,24.13 15.88,25.4 v15.72,25.56 | v29.53,16.83 28.26,16.83 IC1.35 | v21.43,8.73 22.86,8.73 24.13,10 24.13,14.92 v23.97,15.08 23.18,15.88 v23.18,24.13
MTDO  (via drill 0.3)
  Top 0.127: PROG.9 17.78,7.62 18.89,6.51 18.89,4.6 R21.2 19.05,4.45 19.05,3.97 20.16,2.86 20.16,2.38 20.32,2.22 21.59,2.22 24.13,4.76 v25.24,4.76 | v30.32,19.05 30.96,19.05 32.07,20.16 v33.18,20.16
  Bottom 0.127: R2.2 R12.1 33.66,36.2 33.97,35.88 33.97,27.94 33.5,27.46 33.5,23.5 | 33.5,23.5 IC2.IO15 | 30.16,18.41 30.32,18.41 v30.32,19.05 | 30.16,18.41 28.26,18.41 IC1.34 | v33.18,20.16 33.66,20.64 33.66,23.34 33.5,23.5 | v25.24,4.76 25.4,4.92 25.4,8.41 27.15,10.16 30.16,10.16 30.16,18.41
MTMS  (via drill 0.3)
  Top 0.127: v26.04,43.81 20,43.81 19.21,44.61 v17.3,44.61 | v19.68,27.3 v17.62,27.3 | v20.48,14.92 20.48,14.13 19.05,12.7 PROG.8 18.89,12.7 18.89,12.38 16.99,10.48 15.72,10.48 11.11,15.08 11.11,15.4 | v12.7,17.62 12.7,16.99 11.11,15.4 | v26.35,20.8 25.4,21.75 22.86,21.75 21.91,22.7 19.21,22.7 19.05,22.86 14.29,22.86 11.11,19.68 11.11,15.4
  Bottom 0.127: v26.04,43.81 26.04,41.59 29.21,41.59 R3.2 | v17.3,44.61 17.3,31.27 17.62,30.96 v17.62,27.3 | v19.68,27.3 20,26.99 20,16.51 20.48,16.03 v20.48,14.92 | IC2.IO14 12.7,19.68 v12.7,17.62 | v26.35,20.8 26.35,20 26.67,19.68 26.67,15.4 28.1,15.4 IC1.36
N$1
  Bottom 0.127: IC2.IO4 31.59,19.68 30.32,20.95 30.32,28.57 31.11,29.37 31.11,37.62 30.64,38.1 J_IO4.2
N$2  (via drill 0.3)
  Top 0.127: v32.38,30.32 31.43,30.32 Q2.1 | v33.5,35.08 34.61,35.08 35.4,35.88 v37.47,35.88 | v35.4,32.07 36.51,32.07 R45.2
  Bottom 0.127: v32.38,30.32 33.02,30.96 33.02,34.61 v33.5,35.08 | v37.47,35.88 37.47,33.34 36.2,32.07 v35.4,32.07 34.92,32.07 34.92,29.84 36.2,28.57 T2.C
N$3
  Top 0.127: R.6 J_R6.1
N$4
  Top 0.127: R18.1 8.73,4.29 10.79,4.29 11.91,3.17 15.88,3.17 LED_G.A
N$5
  Top 0.127: R.7 J_R7.1
N$6  (via drill 0.3)
  Top 0.127: v23.97,17.62 22.86,17.62 22.54,17.3 22.54,17.14 21.91,16.51 J_P1.2 | v25.4,10.95 25.88,10.48 26.19,10.48 27.78,8.89 27.78,7.62 PROG.1
  Bottom 0.127: v23.97,17.62 24.77,16.83 24.77,11.59 v25.4,10.95
N$12
  Top 0.127: R.8 J_R8.1
N$18
  Bottom 0.127: T2.B 38.42,29.53 R23.2
N$20
  Top 0.127: R20.1 21.91,4.45 21.91,4.13 20.95,3.17 LED_R.A
N$21
  Top 0.127: R21.1 17.46,4.45 17.46,4.13 18.41,3.17 LED_B.A
N$24
  Top 0.127: L.7 J_L7B.2
  Bottom 0.127: L.7 J_L7B.2
N$25
  Top 0.127: L.6 R19.1
  Bottom 0.127: L.6 J_L6.2
N$27
  Top 0.127: L.8 J_L8B.2
  Bottom 0.127: L.8 J_L8B.2
N$28
  Top 0.127: L.5 R34.1
  Bottom 0.127: L.5 J_L5.2
N$29
  Top 0.127: L.4 R35.1
  Bottom 0.127: L.4 J_L4.2
N$30
  Top 0.127: L.2 R37.1
  Bottom 0.127: L.2 J_L2.2
N$31
  Top 0.127: L.3 R36.1
  Bottom 0.127: L.3 J_L3.2
N$32
  Bottom 0.127: L.1 J_L1.2
N$34  (via drill 0.3)
  Top 0.127: v24.92,17.78 24.45,18.26 24.45,19.05 J_P2.2 | v25.4,13.81 26.51,12.7 PROG.2
  Bottom 0.127: v24.92,17.78 25.08,17.62 25.08,14.13 v25.4,13.81
OLED_SCL  (via drill 0.3)
  Top 0.127: R31.2 41.91,46.67 42.39,46.2 42.39,44.93 OLED.3 33.02,43.18 28.73,47.47 20,47.47 19.21,48.26 18.26,48.26 v17.3,47.31 | v6.99,26.67 7.78,26.67 v7.94,26.83 | v16.03,23.65 12.7,26.99 12.54,26.99 12.06,27.46 v12.06,27.62
  Bottom 0.127: J_L8B.1 6.99,26.04 v6.99,26.67 | v7.94,26.83 8.41,27.3 10.16,27.3 IC1.15 10.16,27.62 v12.06,27.62 | IC2.IO27 16.03,18.41 v16.03,23.65 16.19,23.81 16.19,32.23 16.99,33.02 16.99,34.13 15.56,35.56 15.56,45.56 v17.3,47.31
OLED_SDA  (via drill 0.3)
  Top 0.127: OLED.4 39.69,46.67 39.69,47.62 R30.2 | v6.67,24.13 6.99,24.13 7.14,23.97 v8.73,23.97 | v19.05,47.78 18.73,47.78 v18.26,47.31 | v18.57,26.35 17.94,26.35 17.62,26.04 14.13,26.04 v12.7,27.46
  Bottom 0.127: J_L7B.1 6.67,23.18 v6.67,24.13 | 10.16,23.97 v8.73,23.97 | IC1.13 10.16,23.97 | IC2.IO26 12.06,17.14 12.06,22.7 10.79,23.97 | 10.16,23.97 10.79,23.97 | 10.16,24.29 IC1.13 | OLED.4 41.75,46.83 41.75,49.21 40.8,50.16 19.05,50.16 v19.05,47.78 | v18.26,47.31 18.26,34.61 17.62,33.97 17.62,31.91 18.41,31.11 18.89,31.11 19.21,30.8 19.21,26.99 v18.57,26.35 | v12.7,27.46 11.43,26.19 11.43,24.61 10.79,23.97 | 10.79,23.97 IC1.13
S2_IO1  (via drill 0.3)
  Top 0.127: 8.26,10.16 R37.2 | 8.26,10.16 v8.26,11.27 | 8.26,10.16 R38.1
  Bottom 0.127: v8.26,11.27 8.26,10.95 10.16,10.95 IC1.4
S2_IO2  (via drill 0.3)
  Top 0.127: 7.78,12.7 R39.1 8.26,12.7 | 7.78,12.7 R36.2 | 7.78,12.7 v8.89,11.59
  Bottom 0.127: v8.89,11.59 8.89,12.22 10.16,12.22 IC1.5
S2_IO3  (via drill 0.3)
  Top 0.127: R40.1 7.62,15.24 | 7.62,15.24 R35.2 | 7.62,15.24 v8.73,14.13
  Bottom 0.127: v8.73,14.13 8.73,13.97 10.16,13.97 IC1.6
S2_IO4  (via drill 0.3)
  Top 0.127: R41.1 7.46,17.78 | 7.46,17.78 R34.2 | 7.46,17.78 v8.73,16.51
  Bottom 0.127: v8.73,16.51 8.73,15.4 10.16,15.4 IC1.7
S2_IO5  (via drill 0.3)
  Top 0.127: R42.1 7.46,20.32 | 7.46,20.32 R19.2 | 7.46,20.32 v8.57,21.43
  Bottom 0.127: v8.57,21.43 8.1,20.95 8.1,16.99 10.16,16.99 IC1.8
S2_IO45  (via drill 0.3)
  Top 0.127: 32.86,4.92 32.86,6.03 R16.1 | 32.86,4.92 32.86,3.97 R17.2 | v29.53,8.89 v29.53,10.64 | 32.86,4.92 v30.32,4.92
  Bottom 0.127: v29.53,10.64 29.53,10.79 28.26,10.79 IC1.39 | v29.53,8.89 30.32,8.1 v30.32,4.92
S2_IO46  (via drill 0.3)
  Top 0.127: v29.84,3.81 30.96,3.81 R44.2 | v29.53,8.26 29.37,8.1 29.37,7.46 30.64,6.19 30.96,6.19 R43.1
  Bottom 0.127: v29.84,3.81 29.37,4.29 29.37,8.26 | 29.37,8.26 29.37,8.41 28.57,9.21 28.26,9.21 IC1.40 | 29.37,8.26 v29.53,8.26
SD_CLK
  Bottom 0.127: R6.2 R3.1 31.91,42.55 31.91,43.02 29.21,45.72 29.21,49.21 24.13,49.21 23.18,48.26 23.18,33.66 22.7,33.18 SDCARD.5
SD_CMD  (via drill 0.3)
  Top 0.127: v14.13,46.35 14.61,46.35 16.83,44.13 19.21,44.13 v20.48,42.86 | v30.16,35.08 30.16,35.56 28.57,37.15 24.77,37.15 23.81,36.2 23.81,34.29 23.5,33.97 19.53,33.97 v19.21,34.29
  Bottom 0.127: R7.2 14.13,41.91 v14.13,46.35 | 20.48,34.29 20.48,33.18 SDCARD.3 | 20.48,34.29 v20.48,42.86 | v30.16,35.08 R2.1 | 20.48,34.29 v19.21,34.29
SD_D0  (via drill 0.3)
  Top 0.127: v29.21,34.13 28.57,34.77 v25.56,34.77 | v29.84,23.18 v30.8,24.13 | v23.02,25.72 v22.07,26.67 | v26.83,26.67 v25.08,26.67
  Bottom 0.127: 30,31.91 29.21,32.7 v29.21,34.13 | 30,31.91 R4.2 30,31.91 | v25.56,34.77 24.92,34.13 24.92,33.18 SDCARD.7 | IC2.IO2 30.8,22.23 v30.8,24.13 | v29.84,23.18 30,23.34 30,26.67 | 30,31.91 30,26.67 | v22.07,26.67 22.23,26.83 22.23,29.21 22.86,29.84 IC1.24 | v23.02,25.72 23.34,25.72 23.81,26.19 25.08,26.19 v25.08,26.67 | 30,26.67 v26.83,26.67
SD_D1  (via drill 0.3)
  Top 0.127: v11.59,18.41 14.61,18.41 v15.24,19.05 | v15.56,20 16.51,20 18.41,21.91 v22.07,21.91 | v25.4,27.62 v23.18,27.62
  Bottom 0.127: R5.2 J_IO4.1 32.07,38.1 32.07,38.42 31.11,39.37 31.11,43.34 30.96,43.5 29.37,43.5 29.05,43.18 29.05,41.91 27.46,41.91 26.99,42.39 26.99,43.66 25.88,44.77 25.88,47.31 25.24,47.31 24.92,46.99 24.92,41.75 26.04,40.64 26.04,33.18 SDCARD.8 26.04,33.02 26.04,32.54 26.67,31.91 26.67,28.89 v25.4,27.62 | v11.59,18.41 10.16,18.41 IC1.9 | v15.24,19.05 15.56,19.37 v15.56,20 | v22.07,21.91 22.54,22.38 22.54,26.99 v23.18,27.62
SD_D2  (via drill 0.3)
  Top 0.127: v18.26,31.91 17.14,31.91 16.83,31.59 15.72,31.59 15.56,31.75 14.61,31.75 14.13,31.27 13.81,31.27 v12.22,32.86
  Bottom 0.127: R15.1 R9.2 | v18.26,31.91 18.26,33.02 SDCARD.1 | v12.22,32.86 11.11,33.97 R15.1 | R15.1
SD_D3  (via drill 0.3)
  Top 0.127: v19.37,31.27 18.89,30.8 12.86,30.8 9.84,33.81 9.84,38.1 10.32,38.58 v12.86,38.58
  Bottom 0.127: 11.11,38.58 11.59,38.1 R1.1 11.11,38.58 | 11.11,38.58 R8.2 | v19.37,31.27 19.37,33.02 SDCARD.2 | 11.11,38.58 v12.86,38.58
SPI_CS0  (via drill 0.3)
  Top 0.127: 32.07,15.88 32.07,16.35 R14.2 32.07,15.88 | 32.07,15.88 32.07,15.72 | 32.07,15.72 32.07,14.92 R13.1 | 32.07,15.88 v33.18,15.88 | v29.53,23.97 v29.53,27.15 | 32.07,15.72 v29.69,15.72 | v8.57,26.83 4.76,30.64 4.76,35.08 | 4.76,35.08 4.76,35.56 2.86,37.47 SPI.7 | v27.46,32.23 24.61,32.23 23.18,33.66 19.21,33.66 v18.57,34.29 | 4.76,35.08 v5.71,35.08
  Bottom 0.127: v33.18,15.88 IC2.IO5 | 29.53,27.3 28.26,27.3 IC1.28 | v29.53,23.97 29.21,23.65 26.99,23.65 26.99,22.23 27.15,22.07 29.37,22.07 29.37,19.21 29.21,19.05 26.99,19.05 26.99,16.19 27.15,16.03 29.69,16.03 v29.69,15.72 | J_L5.1 6.83,18.26 6.83,19.05 7.46,19.68 7.46,21.27 7.78,21.59 7.78,23.81 8.26,24.29 8.26,26.51 v8.57,26.83 | 29.53,27.3 29.69,27.46 29.69,30 v27.46,32.23 | v18.57,34.29 18.57,46.99 18.73,47.15 18.73,47.47 18.1,48.1 14.45,48.1 14.13,47.78 11.43,47.78 10.95,48.26 5.71,48.26 v5.71,35.08 | 29.53,27.3 v29.53,27.15
SPI_CS1  (via drill 0.3)
  Top 0.127: v15.24,16.99 15.72,17.46 15.88,17.46 16.67,18.26 16.67,18.89 16.99,19.21 v18.89,19.21 | v19.53,25.4 22.7,25.4 23.18,24.92 23.97,24.92 24.13,24.77 | v26.51,22.38 24.13,24.77 | v7.14,37.62 7.14,38.26 SPI.8 6.67,39.69 6.67,43.97 10.48,47.78 14.45,47.78 15.4,46.83 v25.4,46.83 | v24.61,25.24 24.13,24.77
  Bottom 0.127: IC2.IO25 15.24,15.88 v15.24,16.99 | v18.89,19.21 19.53,19.84 v19.53,25.4 | v26.51,22.38 26.67,22.23 26.67,22.07 27.3,21.43 28.1,21.43 IC1.32 | J_L6.1 7.14,21.11 7.14,21.43 7.46,21.75 7.46,23.97 7.78,24.29 7.78,26.35 7.46,26.67 7.46,31.91 7.14,32.23 v7.14,37.62 | v24.61,25.24 26.99,27.62 26.99,29.53 27.3,29.84 27.3,31.75 26.67,32.38 26.67,37.31 26.35,37.62 26.35,40.8 25.4,41.75 v25.4,46.83
SPI_MISO  (via drill 0.3)
  Top 0.127: v29.84,4.45 29.05,4.45 28.73,4.13 v24.92,4.13 | v3.97,31.27 SPI.1 | v5.24,31.59 5.87,32.23 7.14,32.23 7.62,32.7 9.05,32.7 v10.16,31.59 | v12.06,32.23 12.7,31.59 v12.86,31.59 | v15.72,27.15 16.83,27.15 v17.46,26.51 | v17.78,24.45 18.26,24.45 18.73,23.97 22.7,23.97 23.02,23.65 v23.65,23.65
  Bottom 0.127: J_L2.1 8.26,8.26 8.26,2.06 9.84,0.48 24.77,0.48 24.77,4.13 | 24.77,4.13 24.77,11.11 24.45,11.43 24.45,16.51 23.5,17.46 23.5,23.5 v23.65,23.65 25.72,25.72 28.1,25.72 IC1.29 | IC2.IO23 30.8,5.71 30.8,4.76 30.48,4.45 v29.84,4.45 | 24.77,4.13 v24.92,4.13 | v3.97,31.27 5.24,31.27 v5.24,31.59 | v10.16,31.59 12.06,31.59 v12.06,32.23 | v12.86,31.59 13.18,31.27 13.18,28.73 13.81,28.1 14.92,28.1 14.92,27.94 v15.72,27.15 | v17.46,26.51 17.78,26.19 v17.78,24.45
SPI_MOSI  (via drill 0.3)
  Top 0.127: v33.66,16.51 32.7,17.46 v30.64,17.46 30,16.83 30,16.67 28.73,15.4 28.73,5.71 v28.26,5.24 | v5.71,13.97 1.59,13.97 0.79,14.76 0.79,26.35 v3.17,28.73 | v5.56,32.54 6.51,32.54 SPI.4 | v28.26,2.54 22.38,2.54 21.75,1.91 10.32,1.91 9.53,1.11 7.3,1.11 v6.83,1.59
  Bottom 0.127: IC2.IO19 33.66,13.34 v33.66,16.51 | v30.64,17.46 30.8,17.62 30.8,20 29.69,21.11 29.69,22.23 29.21,22.7 28.26,22.7 IC1.31 | 5.71,13.34 J_L3.1 | v5.71,13.97 5.71,13.34 | v3.17,28.73 5.71,31.27 5.71,32.38 v5.56,32.54 | v28.26,2.54 v28.26,5.24 | v6.83,1.59 1.75,6.67 0.79,6.67 0.79,10.64 1.75,11.59 5.71,11.59 5.71,13.34
SPI_ON  (via drill 0.3)
  Top 0.127: v28.1,29.84 28.1,28.73 J_RSO.2
  Bottom 0.127: v28.1,29.84 28.1,28.89 IC1.27
SPI_RESET  (via drill 0.3)
  Top 0.127: J_BR.3 28.1,25.88 28.1,27.15 J_RSO.1 27.94,27.15 22.7,27.15 22.07,27.78 v21.27,27.78 | J_L7.1 8.1,22.86 v8.89,22.07 10.16,23.34 12.7,23.34 12.86,23.18 14.45,23.18 | 14.45,23.18 v21.27,23.18 | v3.97,33.5 SPI.5 | v6.19,30 7.62,30 14.45,23.18
  Bottom 0.127: v8.89,22.07 10.16,22.07 IC1.11 | v21.27,23.18 v21.27,27.78 | v3.97,33.5 6.19,33.5 v6.19,30
SPI_SCK  (via drill 0.3)
  Top 0.127: v29.37,14.61 v30.64,14.61 | v0.64,30.96 1.11,30.96 SPI.3 | v25.24,21.27 18.26,21.27 16.51,19.53 v11.59,19.53 | v6.35,19.05 v8.89,19.05
  Bottom 0.127: v30.64,14.61 IC2.IO18 | v29.37,14.61 26.35,14.61 26.35,19.37 25.88,19.84 25.88,21.27 | 25.88,21.27 25.88,23.02 27.15,24.29 28.1,24.29 IC1.30 | J_L4.1 5.71,15.88 5.71,16.03 5.08,16.67 0.48,16.67 0.48,19.05 | 0.48,19.05 0.48,30.8 v0.64,30.96 | v25.24,21.27 25.88,21.27 | v11.59,19.53 11.11,19.05 v8.89,19.05 | 0.48,19.05 v6.35,19.05
U0RXD  (via drill 0.3)
  Top 0.127: J_P1.3 20.32,16.35 19.05,16.35 J_U02R.1 18.89,16.51 18.89,17.3 v18.57,17.62 | v29.53,11.27 v30.64,10.16 | v17.94,23.65 22.54,23.65 23.65,22.54 v23.97,22.54
  Bottom 0.127: IC2.RXD0 30.64,9.53 v30.64,10.16 | v29.53,11.27 28.57,12.22 28.26,12.22 IC1.38 28.1,12.38 27.62,12.38 25.72,14.29 25.72,17.62 24.29,19.05 24.29,22.23 v23.97,22.54 | v18.57,17.62 17.94,18.26 v17.94,23.65
U0TXD  (via drill 0.3)
  Top 0.127: 22.86,19.21 21.59,19.21 J_U02T.1 | v30.64,9.05 30.64,9.53 31.11,10 31.11,11.11 v29.53,12.7 | 22.86,19.21 23.5,19.84 23.5,20 23.97,20.48 v24.77,20.48 | 22.86,19.21 J_P2.3
  Bottom 0.127: IC2.TXD0 30.64,8.26 v30.64,9.05 | v29.53,12.7 28.26,13.97 IC1.37 28.1,13.97 26.51,13.97 26.04,14.45 26.04,19.21 v24.77,20.48
U1RXD  (via drill 0.3)  (1 unrouted)
  Top 0.127: v12.7,12.86 v12.7,10.95 | v11.59,15.24 14.29,17.94 v15.72,17.94 | v16.51,20.64 18.26,22.38 v18.89,22.38 | GPS.1 12.06,33.81 v13.49,32.38 | v18.1,27.78 v15.72,27.78
  Bottom 0.127: IC2.IO34 12.7,10.79 v12.7,10.95 | v12.7,12.86 11.59,13.97 v11.59,15.24 | v15.72,17.94 16.51,17.94 v16.51,20.64 | v18.89,22.38 18.73,22.54 18.73,25.56 18.1,26.19 v18.1,27.78 18.1,29.69 18.26,29.84 IC1.21 | v13.49,32.38 14.61,32.38 14.61,28.89 v15.72,27.78
U1TXD  (via drill 0.3)
  Top 0.127: v12.7,15.72 14.61,15.72 v17.14,18.26 | v14.61,37.47 GPS.3 | v14.61,33.34 15.4,33.34 v16.67,32.07
  Bottom 0.127: IC2.IO32 12.7,13.34 v12.7,15.72 | v17.14,18.26 16.99,18.41 16.99,29.84 IC1.20 16.83,30 16.83,31.91 v16.67,32.07 | v14.61,33.34 v14.61,37.47
U2_BUS  (via drill 0.3)
  Top 0.127: 6.51,8.1 6.67,8.26 R33.1 6.51,8.1 | 6.51,8.1 5.87,7.46 | 5.87,7.46 R32.1 | 6.51,8.1 v5.71,8.89 | 5.87,7.46 6.03,7.46 7.14,6.35 D1.A
  Bottom 0.127: J_L1.1 5.71,8.26 v5.71,8.89
U2RXD  (via drill 0.3)
  Top 0.127: v6.35,11.43 5.87,10.95 5.87,9.37 6.03,9.21 7.62,9.21 8.57,8.26 R33.2 | v17.46,11.59 17.46,16.35 J_U02R.2 | v17.46,10.32 17.3,10.32 17.14,10.16 12.54,10.16 12.38,10 v11.59,10
  Bottom 0.127: 7.46,11.43 7.78,11.43 7.78,10.95 8.57,10.16 11.59,10.16 | 7.46,11.43 v6.35,11.43 | 11.59,10.16 11.75,10.16 11.75,10.64 13.18,12.06 IC2.IO35 | v17.46,10.32 v17.46,11.59 | 11.59,10.16 v11.59,10 | 7.46,11.43 7.46,16.51 7.78,16.83 7.78,21.11 8.1,21.43 8.1,22.7 10.16,22.7 IC1.12
U2TXD  (via drill 0.3)
  Top 0.127: v17.94,17.62 19.37,19.05 19.84,19.05 J_U02T.2 | v10.64,5.08 10.64,6.35 D1.C | v11.91,3.81 15.24,7.14 v15.24,9.37 | v15.24,15.24 v12.22,15.24
  Bottom 0.127: v17.94,17.62 16.03,17.62 16.03,16.99 15.56,16.51 15.56,15.72 15.08,15.24 | 15.08,15.24 14.45,14.61 IC2.IO33 | v11.91,3.81 v10.64,5.08 | v15.24,9.37 15.08,9.53 15.08,15.24 | v12.22,15.24 12.22,15.72 11.75,16.19 11.75,17.62 9.05,17.62 8.41,18.26 8.41,19.84 IC1.10 | 15.08,15.24 v15.24,15.24
U5  (via drill 0.3)
  Top 0.508: v42.55,34.45 41.75,35.24 35.4,35.24 33.66,33.5 26.83,33.5 I2C.4
  Bottom 0.508: R.4 42.55,19.68 v42.55,34.45
U33A
  Top 0.508: J_VCCOUT.2 38.1,24.29 J_VCC.3 38.26,22.86 R.2
U33B
  Top 0.508: R.3 40.32,20 38.1,20 J_VCC.1
UBAT  (via drill 0.3)
  Top 0.508: R.5 39.69,15.24 v35.4,19.53 | v35.4,25.08 33.5,26.99 v33.5,28.1 | v33.5,34.29 30,34.29 28.1,36.2 I2C.6
  Bottom 0.508: v35.4,25.08 v35.4,19.53 | v33.5,34.29 v33.5,28.1
UBUS  (via drill 0.3)
  Top 0.508: v36.67,26.04 37.94,26.04 J_VCCOUT.1 | v35.4,26.04 35.4,26.67 34.13,27.94 34.13,28.42 33.18,29.37 30.64,29.37 29.05,30.96 Q2.3 I2C.2 23.97,28.42 12.06,28.42 9.37,31.11 SPI.2 7.78,31.27 v7.78,32.23 | v7.78,40.01 GPS.5
  Bottom 0.508: v35.4,26.04 v36.67,26.04 | v7.78,32.23 v7.78,40.01
USBN  (via drill 0.3)
  Top 0.127: 24.45,16.51 23.5,16.51 J_P1.1 | 24.45,16.51 24.77,16.51 C4.1 24.45,16.51 | v21.11,17.94 23.65,17.94 23.81,18.1 24.13,18.1 24.45,17.78 24.45,16.51
  Bottom 0.127: v21.11,17.94 20.32,18.73 20.32,29.53 20,29.84 IC1.22
USBP  (via drill 0.3)
  Top 0.127: 27.3,19.21 26.04,19.21 J_P2.1 | v21.75,27.3 22.07,27.3 v23.81,25.56 | v23.81,24.45 27.3,20.95 27.3,19.21 | 27.3,19.21 C3.1
  Bottom 0.127: v21.75,27.3 21.75,29.53 21.43,29.84 IC1.23 | v23.81,24.45 v23.81,25.56
VCC  (via drill 0.3)  (1 unrouted)
  Top 0.508: v7.14,43.81 v8.1,43.81 8.26,43.66 18.73,43.66 v20.95,41.43 | v36.83,40.96 38.1,40.96 J_OLED2.3 | R31.1 41.91,49.53 39.69,49.53 R30.1 39.37,49.69 v38.42,49.69 | R18.2 7.14,4.29 7.14,2.86 R27.1 | R32.2 6.99,2.86 R27.1 | v9.37,1.59 8.1,1.59 7.3,2.38 7.3,2.7 R27.1 | v23.81,7.62 PROG.3 25.4,7.46 25.4,6.83 27.62,4.6 28.57,4.6 v29.84,5.87 | 32.07,7.94 32.86,7.94 R16.2 33.02,7.94 34.77,7.94 R26.1 | 32.07,7.94 31.11,7.94 R43.2 30.8,7.78 30.64,7.62 v29.84,7.62 | 32.07,7.94 32.07,12.86 R13.2 32.23,13.02 v35.72,16.51 | v40.64,31.59 40.01,32.23 C6.+ 40.64,33.18 39.69,32.23 38.42,32.23 R45.1 38.26,32.38 38.26,33.02 36.99,34.29 36.35,34.29 | 33.02,30.96 35.88,28.1 R28.1 36.04,27.94 36.04,23.02 37.47,21.59 38.1,21.59 J_VCC.2 37.31,21.43 v36.83,20.95 | 33.02,30.96 32.07,31.91 31.43,31.91 Q2.2 | 33.02,30.96 36.35,34.29 | v36.04,34.61 36.35,34.29
  Bottom 0.508: v7.14,43.81 7.14,44.61 R11.2 | R25.1 8.57,45.24 R29.1 8.57,44.29 v8.1,43.81 9.05,42.86 9.05,42.07 R7.1 9.21,40.16 R8.1 8.73,39.53 8.73,36.67 R9.1 | 35.56,40.96 35.56,38.26 R5.1 35.56,38.1 35.56,36.2 R12.2 35.72,36.04 36.04,35.72 v36.04,34.61 | 35.56,40.96 35.56,42.55 R6.1 35.56,42.7 35.56,48.26 | 35.56,40.96 v36.83,40.96 38.1,40.96 J_OLED2.3 | 35.56,48.26 C5.+ 37.31,48.42 37.31,48.58 v38.42,49.69 | 35.56,48.26 R10.2 32.86,48.42 32.86,49.69 23.97,49.69 21.91,47.62 21.91,41.43 | 21.91,41.43 21.91,33.5 21.59,33.18 SDCARD.4 | 21.91,41.43 v20.95,41.43 | v9.37,1.59 8.73,2.22 8.73,6.99 9.37,7.62 10,7.62 IC1.2 10.16,7.78 10.79,7.78 11.91,6.67 11.91,5.71 IC2.VDD33 14.13,5.87 22.07,5.87 v23.81,7.62 | v40.64,31.59 C2.1 | v35.72,16.51 35.72,18.89 36.83,20 v36.83,20.95 | v29.84,7.62 v29.84,5.87

### Text on the board
tPlace: ESP32 (S2) WROVER V1.0
_tNames: R30 | R31 | BOOT | IO13 | RESET | J_OLED1 | OLED | R45 | C6 | GPS | Q2 | SPI | J_RBO | I2C | C1 | R28 | J_L8 | J_RSO | J_VCCOUT | J_L7 | J_BR | J_BO | J_U02T | J_P2 | C3 | R42 | J_VCC | R19 | R41 | J_U02R | R14 | R34 | C4 | R40 | J_P1 | R35 | R13 | J_R6 | R39 | R36 | J_R7 | R38 | R37 | R43 | R16 | R33 | PROG | L | R32 | D1 | J_R8 | R | R21 | R26 | R18 | R20 | LED_G | LED_B | LED_R | R27 | R44 | R17
_bNames: R25 | R11 | R10 | C5 | R29 | R3 | R6 | R7 | R8 | J_IO4 | SDCARD | R5 | R1 | R9 | J_OLED2 | R2 | R12 | R15 | R23 | R4 | C2 | T2 | J_L8B | J_L7B | J_L6 | J_L5 | J_L4 | J_L3 | J_L2 | J_L1
_tValues: GPS